# Altium schematic sheet Analog_Mux.SchDoc
size A; SheetNumber: 6; SheetTotal: 8
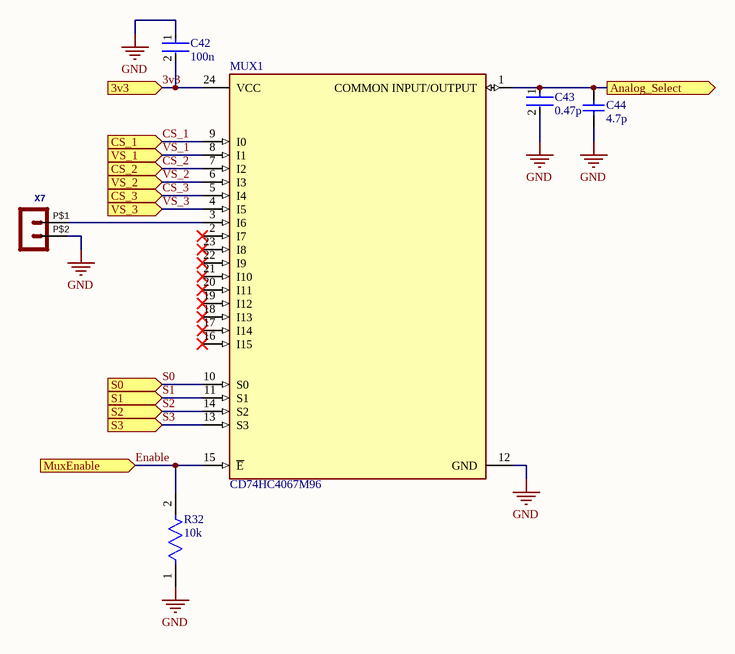
[diagram p0: Analog_Mux.SchDoc]

## Parts
C42  100n  [FP-CGA3E-0_3-0_1-IPC_A]
C43  0.47p  [FP-CL21-IPC_B]
C44  4.7p  [CAPC1608X90X35ML10T15]
MUX1  CD74HC4067M96  [FP-DW0024A-MFG]
R32  10k  [FP-RC0603-0_55-IPC_C]
X7  Molex - Micro-Fit 3.0 Series connector,  3.00mm (0.118") pitch header, 2 positions.  [44914-0201]  (value not drawn)

## Ports
3v3 (in), Analog_Select (out), CS_1 (in), CS_2 (in), CS_3 (in), MuxEnable (in), S0 (in), S1 (in), S2 (in), S3 (in), VS_1 (in), VS_2 (in), VS_3 (in)

## Nets
GND: C42.1 C43.2 C44.1 MUX1.12(GND) R32.1 X7.P$2
3v3: C42.2 MUX1.24(VCC) ; port 3v3
Analog_Select: C43.1 C44.2 MUX1.1(COMMON_INPUT/OUTPUT) ; port Analog_Select
CS_1: MUX1.9(I0) ; port CS_1
CS_2: MUX1.7(I2) ; port CS_2
CS_3: MUX1.5(I4) ; port CS_3
Enable: MUX1.15(~{E}) R32.2 ; port MuxEnable
S0: MUX1.10(S0) ; port S0
S1: MUX1.11(S1) ; port S1
S2: MUX1.14(S2) ; port S2
S3: MUX1.13(S3) ; port S3
VS_1: MUX1.8(I1) ; port VS_1
VS_2: MUX1.6(I3) ; port VS_2
VS_3: MUX1.4(I5) ; port VS_3
NetMUX1_3: MUX1.3(I6) X7.P$1

Not connected (* = marked no-connect by the designer): MUX1 2(I7)* 16(I15)* 17(I14)* 18(I13)* 19(I12)* 20(I11)* 21(I10)* 22(I9)* 23(I8)*

## Library data of the parts
C42 = CMP-2000-07546-2: Cap Ceramic 100nF 50V X7R 10% Pad SMD 0603 +125°C Automotive T/R; Weight: 7.1E-05oz; Composition: Ceramic; Max Operating Temperature: 125°C; Termination: SMD/SMT; Dielectric: X7R; Length: 1.6mm; Package Quantity: 1; REACH SVHC: No SVHC; Lead Free: Lead Free; Case Code (Metric): 1608; Min Operating Temperature: -55°C; Packaging: Tape and Reel; Tolerance: 10%; Voltage Rating: 50V; Case Code (Imperial): 0603; Capacitance: 100nF; Case/Package: 0603; Voltage Rating (DC): 50V; Depth: 0.8mm; Radiation Hardening: No; Ratings: AEC-Q200; Mount: Surface Mount; Voltage: 50V; Thickness: 0.035inch; Width: 0.8mm; Height: 0.8mm
C43 = CMP-13271-000950-1: CL21 Series 0805 0.47pF 50V ±0.1pF Tolerance C0G Multilayer Ceramic Chip Capacitor; Temperature Coefficient: 300ppm/°C; Length: 2mm; Case Code (Metric): 2012; Width: 0.049inch; Case Code (Imperial): 0805; Radiation Hardening: No; Voltage: 50V; Height: 0.65mm; Voltage Rating (DC): 50V; Package Quantity: 1; Capacitance: 0.47pF; Voltage Rating: 50V; Max Operating Temperature: 125°C; Min Operating Temperature: -55°C; Dielectric: C0G; Depth: 1.25mm; Thickness: 0.03inch; Lead Free: Lead Free; Packaging: Tape and Reel; Case/Package: 0805; Mount: Surface Mount
C44 = CMP-2006-02676-1: Part Number: GRM1885C1H4R7CA01D; Manufacturer: Murata
MUX1 = CMP-04901-000007-1: IC MUX/DEMUX 1X16 24SOIC; Manufacturer: Texas Instruments; Standoff Height: 0.1mm; Logic Function Desc: Non-Inverting; Max Supply Voltage: 6V; Number Of Inputs: 16; Quiescent Current: 8uA; Number Of Circuits: 1; Propagation Delay: 6ns; Max Junction Temp: +150°C; Min Supply Voltage: 2V; ComponentLink2Description: Datasheet; Octopart: https://octopart.com/cd74hc4067m96-texas+instruments-722802; Ambient Temperature Range High: +125°C; Ipc Land Pattern Name: SOIC127P1030X265-24; Height: 2.65mm; Mouser Description: Multiplexer Switch ICs Hi-Spd CMOS 16Ch Anl Mltplxr/Demltplxr; Temperature Range Low: -55°C; Package: DW0024A; Temperature Range High: +125°C; Lead Free: Yes; ComponentLink2URL: http://www.ti.com/lit/ds/symlink/cd74hc4067.pdf; Manufacturer Part Number: CD74HC4067M96; RoHS: TRUE; Automotive: No; Device Class L1: Integrated Circuits (ICs); Digikey Description: IC MUX/DEMUX 1X16 24SOIC; Device Class L2: Logic ICs; Temperature: -55°C to +125°C; Device Class L3: Multiplexers; Category: IC; Ambient Temperature Range Low: -55°C; Number Of Outputs: 1
R32 = CMP-2100-03664-2: RES 10K OHM 1% 1/10W 0603; Voltage Rating: 75V; Voltage Rating (DC): 50V; Resistance: 10kR; Power Rating: 100mW; Temperature Coefficient: 100ppm/°C; Depth: 0.8mm; Termination: SMD/SMT; Resistor Type: Thick Film; Series: RC; Construction: Rectangular; Features: Moisture Resistant; Packaging: Tape and Reel; Min Operating Temperature: -55°C; Number of Terminations: 2; Lead Pitch: 0.3mm; RoHS Compliant: Yes; Case/Package: 0603; Resistance Tolerance: 1%; Military Standard: Not; Weight: 7.1E-05oz; Number of Pins: 2; Tolerance: 1%; Length: 1.6mm; Case Code (Imperial): 0603; Lead Free: Lead Free; Width: 0.8mm; Max Power Dissipation: 100mW; Height: 0.45mm; Max Operating Temperature: 155°C; Case Code (Metric): 1608; Size Code: 0603
X7 = HEADER_POS2_?44914-0201: GateName_1: G$1; SymbolName_1: HEADER_POS2; DeviceName: 44914-0201; LibraryName: con-molex-micro-fit-3_0_2; DeviceSetName: HEADER_POS2_?; Package: 44914-0201